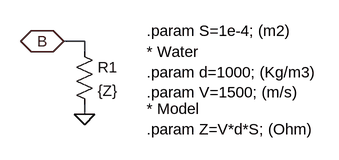
[diagram p0: schematic SubstInf.asc]
SubstInf.asc, the LTspice schematic file:
Version 4
SHEET 1 1424 680
WIRE 320 -96 288 -96
WIRE 320 -80 320 -96
WIRE 320 16 320 0
FLAG 288 -96 B
IOPIN 288 -96 BiDir
FLAG 320 16 0
SYMBOL res 304 -96 R0
SYMATTR InstName R1
SYMATTR Value {Z}
TEXT 416 -80 Left 0 !* Water\n.param d=1000; (Kg/m3)\n.param V=1500; (m/s)
TEXT 416 8 Left 0 !* Model\n.param Z=V*d*S; (Ohm)
TEXT 416 -112 Left 0 !.param S=1e-4; (m2)

The netlist it stands for:
* SubstInf.asc
R1 B 0 {Z}
* Water
.param d=1000; (Kg/m3)
.param V=1500; (m/s)
* Model
.param Z=V*d*S; (Ohm)
.param S=1e-4; (m2)
.backanno
.end